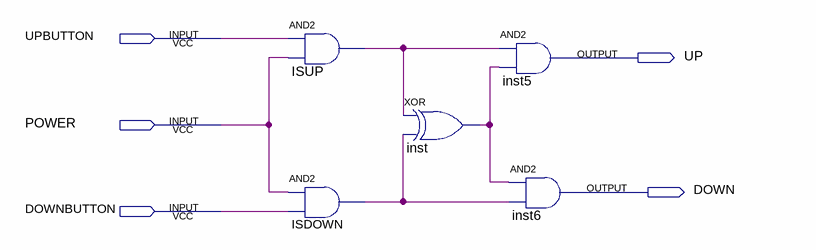
[diagram p0: schematic sheet]
// Quartus schematic UpDown.bdf as structural Verilog: 5 symbols, 5 pins
module UpDown (
  input  UPBUTTON,
  input  POWER,
  input  DOWNBUTTON,
  output UP,
  output DOWN
);

  wire inst_out, ISDOWN_out, ISUP_out;

  and ISUP (ISUP_out, UPBUTTON, POWER);
  and ISDOWN (ISDOWN_out, POWER, DOWNBUTTON);
  xor inst (inst_out, ISUP_out, ISDOWN_out);
  and inst5 (UP, ISUP_out, inst_out);
  and inst6 (DOWN, inst_out, ISDOWN_out);
endmodule
